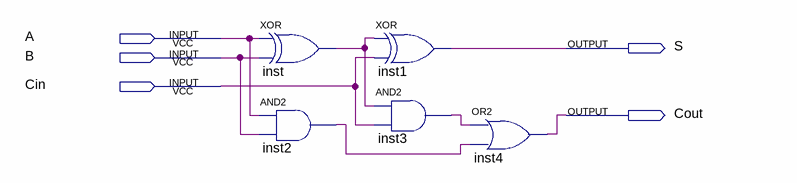
[diagram p0: schematic sheet]
// Quartus schematic OneBitAdder.bdf as structural Verilog: 5 symbols, 5 pins
module OneBitAdder (
  input  A,
  input  B,
  input  Cin,
  output S,
  output Cout
);

  wire inst2_out, inst3_out, inst_out;

  xor inst (inst_out, A, B);
  and inst2 (inst2_out, A, B);
  xor inst1 (S, inst_out, Cin);
  and inst3 (inst3_out, inst_out, Cin);
  or inst4 (Cout, inst3_out, inst2_out);
endmodule
